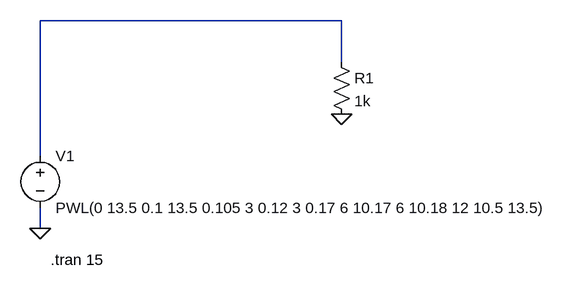
[diagram p0: schematic Cold Crank ISO 7637-2 Test Pulse 4.asc]
Cold Crank ISO 7637-2 Test Pulse 4.asc, the LTspice schematic file:
Version 4.1
SHEET 1 880 680
WIRE 416 -64 -48 -64
WIRE 416 0 416 -64
WIRE -48 144 -48 -64
WIRE -48 256 -48 224
FLAG -48 256 0
FLAG 416 80 0
SYMBOL voltage -48 128 R0
WINDOW 123 0 0 Left 0
WINDOW 39 0 0 Left 0
SYMATTR InstName V1
SYMATTR Value PWL(0 13.5 0.1 13.5 0.105 3 0.12 3 0.17 6 10.17 6 10.18 12 10.5 13.5)
SYMBOL res 400 -16 R0
SYMATTR InstName R1
SYMATTR Value 1k
TEXT -32 304 Left 2 !.tran 15

The netlist it stands for:
* Cold Crank ISO 7637-2 Test Pulse 4.asc
V1 N001 0 PWL(0 13.5 0.1 13.5 0.105 3 0.12 3 0.17 6 10.17 6 10.18 12 10.5 13.5)
R1 N001 0 1k
.tran 15
.backanno
.end